# Altium schematic sheet CAN_IF.SchDoc
size B; SheetNumber: 4; SheetTotal: 6
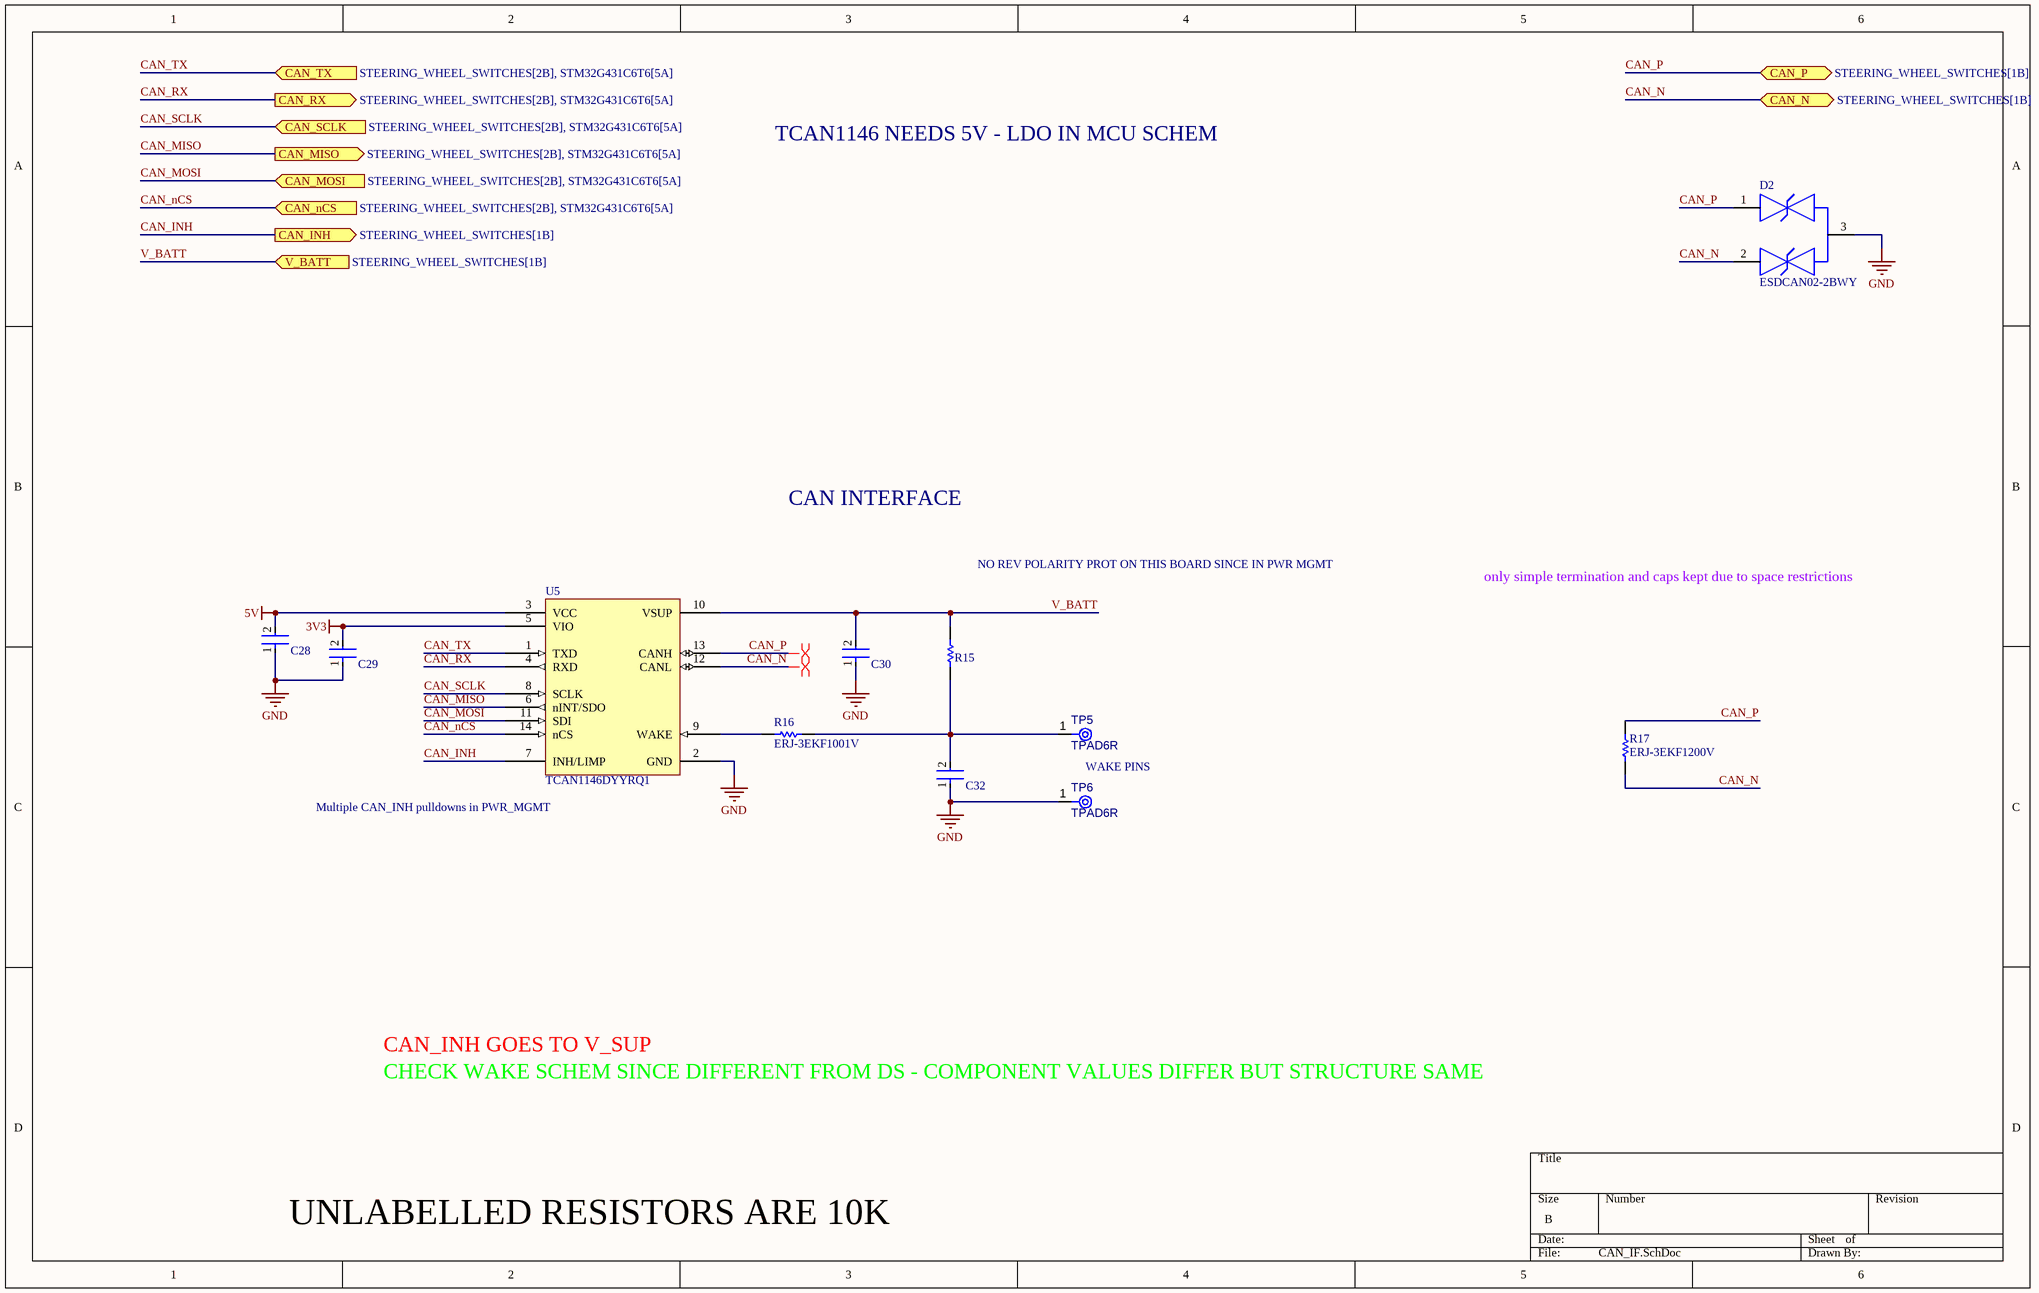
[diagram p0: CAN_IF.SchDoc]

## Parts
C28  C0402C104K8PACTU  [FP-C0402-BB-MFG]  (value not drawn)
C29  C0402C104K8PACTU  [FP-C0402-BB-MFG]  (value not drawn)
C30  C0402C104K8PACTU  [FP-C0402-BB-MFG]  (value not drawn)
C32  C0402C104K8PACTU  [FP-C0402-BB-MFG]  (value not drawn)
D2  ESDCAN02-2BWY  [FP-SOT323-3L-MFG]
R15  ERJ3EKF1002V  [RESC1609X55X30LL15T15]  (value not drawn)
R16  ERJ-3EKF1001V  [RESC1608X55X30LL15T15]
R17  ERJ-3EKF1200V  [RESC1609X55X30ML15T15]
TP5  TPAD6R  [TP06R]  (no BOM)
TP6  TPAD6R  [TP06R]  (no BOM)
U5  TCAN1146DYYRQ1  [TCAN1146DYYRQ1-Footprint-1]

## Ports
CAN_INH (out, see STEERING_WHEEL_SWITCHES[1B]), CAN_MISO (out, see STEERING_WHEEL_SWITCHES[2B], STM32G431C6T6[5A]), CAN_MOSI (in, see STEERING_WHEEL_SWITCHES[2B], STM32G431C6T6[5A]), CAN_N (bidir, see STEERING_WHEEL_SWITCHES[1B]), CAN_nCS (in, see STEERING_WHEEL_SWITCHES[2B], STM32G431C6T6[5A]), CAN_P (bidir, see STEERING_WHEEL_SWITCHES[1B]), CAN_RX (out, see STEERING_WHEEL_SWITCHES[2B], STM32G431C6T6[5A]), CAN_SCLK (in, see STEERING_WHEEL_SWITCHES[2B], STM32G431C6T6[5A]), CAN_TX (in, see STEERING_WHEEL_SWITCHES[2B], STM32G431C6T6[5A]), V_BATT (in, see STEERING_WHEEL_SWITCHES[1B])

## Nets
3V3: C29.2 U5.5(VIO)
5V: C28.2 U5.3(VCC)
GND: C28.1 C29.1 C30.1 C32.1 D2.3 TP6.1(TP) U5.2(GND)
CAN_INH: U5.7(INH/LIMP) ; port CAN_INH
CAN_MISO: U5.6(nINT/SDO) ; port CAN_MISO
CAN_MOSI: U5.11(SDI) ; port CAN_MOSI
CAN_N: D2.2 R17.2 U5.12(CANL) ; port CAN_N
CAN_nCS: U5.14(nCS) ; port CAN_nCS
CAN_P: D2.1 R17.1 U5.13(CANH) ; port CAN_P
CAN_RX: U5.4(RXD) ; port CAN_RX
CAN_SCLK: U5.8(SCLK) ; port CAN_SCLK
CAN_TX: U5.1(TXD) ; port CAN_TX
V_BATT: C30.2 R15.1 U5.10(VSUP) ; port V_BATT
NetC32_2: C32.2 R15.2 R16.2 TP5.1(TP)
NetR16_1: R16.1 U5.9(WAKE)

## Layout directives
differential pair; differential pair class 120DIFF: CAN_N, CAN_P

## Notes on the sheet
- TCAN1146 NEEDS 5V - LDO IN MCU SCHEM
- CAN INTERFACE
- NO REV POLARITY PROT ON THIS BOARD SINCE IN PWR MGMT
- only simple termination and caps kept due to space restrictions
- WAKE PINS
- (near U5) Multiple CAN_INH pulldowns in PWR_MGMT
- CHECK WAKE SCHEM SINCE DIFFERENT FROM DS - COMPONENT VALUES DIFFER BUT STRUCTURE SAME
- CAN_INH GOES TO V_SUP
- UNLABELLED RESISTORS ARE 10K

## Library data of the parts
C28-C30 C32 = CMP-2008-02046-2: CAP CER 0.1UF 10V X5R 0402; Manufacturer: Kemet; Material: Ceramic; Capacitance: 0.10 μF; Temperature Coefficient: 15%; Tolerance: 0.1; Value: 0.10 μF; Package: C0402-BB; Temperature: -55°C to +125°C; ComponentLink2Description: Datasheet; Temperature Characteristic: X5R; Device Class L1: Passive Components; Height: 0.55mm; Lead Free: Yes; ComponentLink2URL: https://content.kemet.com/datasheets/KEM_C1002_X7R_SMD.pdf; Device Class L2: Capacitors; Temperature Range Low: -55°C; Temperature Range High: +125°C; RoHS: TRUE; Octopart: https://octopart.com/c0402c104k8pactu-kemet-140039; Automotive: No; Mouser Description: Capacitor 100 nF 10 VDC 0402; Category: Cap; Voltage Rating: 10 V; Digikey Description: CAP CER 0.1UF 10V X5R 0402; Ipc Land Pattern Name: CAPC10050X50; Device Class L3: Ceramic Capacitors; Manufacturer Part Number: C0402C104K8PACTU
D2 = CMP-12225-000055-1: TVS DIODE 26.5V 44V SOT323-3; Manufacturer: STMicroelectronics; Value: 3pF; Direction: Bidirectional; Breakdown Voltage: 28.5V; Automotive Grade: Grade 0; Standoff Height: 0mm; Peak Pulse Power: 170W; Peak Pulse Current: 3A; Number Of Channels: 2; Max Junction Temp: +175°C; Mouser Description: TVS Diodes / ESD Suppressors Automotive dual-line Transil, Transient voltage suppressor (TVS) for CAN bus; Height: 1.1mm; Category: Diode; Reverse Standoff Voltage: 26.5V; Device Class L1: Circuit Protection; Temperature: -55°C to +175°C; RoHS: TRUE; ComponentLink2URL: https://www.st.com/resource/en/datasheet/esdcan02-2bwy.pdf; Device Class L3: unset; Device Class L2: TVS Diodes; Temperature Range High: +175°C; Octopart: https://octopart.com/esdcan02-2bwy-stmicroelectronics-58631133; Ipc Land Pattern Name: SOT65P210X95-3; Temperature Range Low: -55°C; Capacitance: 3pF; Digikey Description: TVS DIODE 26.5V 44V SOT323-3; Automotive: Yes; ComponentLink2Description: Datasheet; Clamping Voltage: 44V; Manufacturer Part Number: ESDCAN02-2BWY; Lead Free: Yes; Package: SOT323-3L
R15 = CMP-1012-00623-3: Chip Resistor, 10 KOhm, +/- 1%, 0.1 W, -55 to 155 degC, 0603 (1608 Metric), RoHS, Tape and Reel; Manufacturer: Panasonic; Voltage Rating: 75V; Case\/Package: 0603; Power Rating: 100mW; Resistance: 10KOhm; Temperature Coefficient: 100ppm\/degreesC; Number of Pins: 2; Package Reference: 603; Depth: 0.8mm; Mount: SurfaceMount; Package Description: 2-Pin Surface Mount Device, Body 1.6 x 0.85 mm; Datasheet Version: 02/2017; Length: 1.6mm; Lead Free: LeadFree; Height: 0.45mm; Number of Terminations: 2; Max Power Dissipation: 100mW; Min Operating Temperature: -55degC; Datasheet URL: https://industrial.panasonic.com/cdbs/www-data/pdf/RDA0000/AOA0000C304.pdf; Termination: SMD/SMT; Case Code (Metric): 1608; Case Code (Imperial): 0603; Tolerance: 1%; Max Operating Temperature: 155degC; RoHSCompliant: true; Voltage Rating (DC): 75V; Radiation Hardening: No; Packaging: TapeandReel; Composition: ThickFilm; Mounting Technology: SurfaceMount; Manufacturer URL: http://www.panasonic.com/; Width: 0.031inch; REACH SVHC: NoSVHC; Contact Plating: Tin; Military Standard: Not; Package Quantity: 1
R16 = CMP-2000-00180-1: Manufacturer: Panasonic; Part Number: ERJ-3EKF1001V
R17 = CMP-2000-00213-2: Chip Resistor, 120 Ohm, +/- 1%, 0.1 W, -55 to 155 degC, 0603 (1608 Metric), RoHS, Tape and Reel; Manufacturer: Panasonic; Power Rating: 100mW; Voltage Rating (DC): 75V; Resistance: 120Ohm; Temperature Coefficient: 100ppm/degreesC; Number of Terminations: 2; Military Standard: Not; Tolerance: 1%; Min Operating Temperature: -55degC; Packaging: TapeandReel; Lead Free: LeadFree; Max Operating Temperature: 155degC; Manufacturer URL: http://www.panasonic.com/; Case Code (Imperial): 0603; REACH SVHC: NoSVHC; Width: 0.031inch; Datasheet URL: https://industrial.panasonic.com/cdbs/www-data/pdf/RDA0000/AOA0000C283.pdf; RoHSCompliant: true; Max Power Dissipation: 100mW; Termination: SMD/SMT; Package Reference: 0603; Height: 0.022inch; Depth: 0.8mm; Package Description: 2-Pin Surface Mount Device, Body 1.6 x 0.85 mm; Contact Plating: Tin; Length: 1.6mm; Package URL: http://www.st.com/st-web-ui/static/active/en/resource/technical/document/datasheet/CD00001320.pdf; Radiation Hardening: No; Package Quantity: 1; Number of Pins: 2; Datasheet Version: 42095.0; Voltage Rating: 75V; Composition: ThickFilm; Case/Package: 0603; Mount: SurfaceMount; Case Code (Metric): 1608
TP5 TP6 = CMP-00028-00002-3: 0.6mm round; Pins: 1
U5 = CMP-015-00012-2: Automotive CAN FD transceiver with watchdog, bus diagnostics and partial networking via sele 14-SOT-23-THIN -40 to 150